# Altium schematic sheet PG13_ REGS_MANAGER.SchDoc: BMU - Regulators
size B; Address1: 3511 EDISON WAY; Address2: MENLO PARK, CA, 94025; DocumentNumber: 1; Revision: 4.1; SheetNumber: 8; SheetTotal: 9
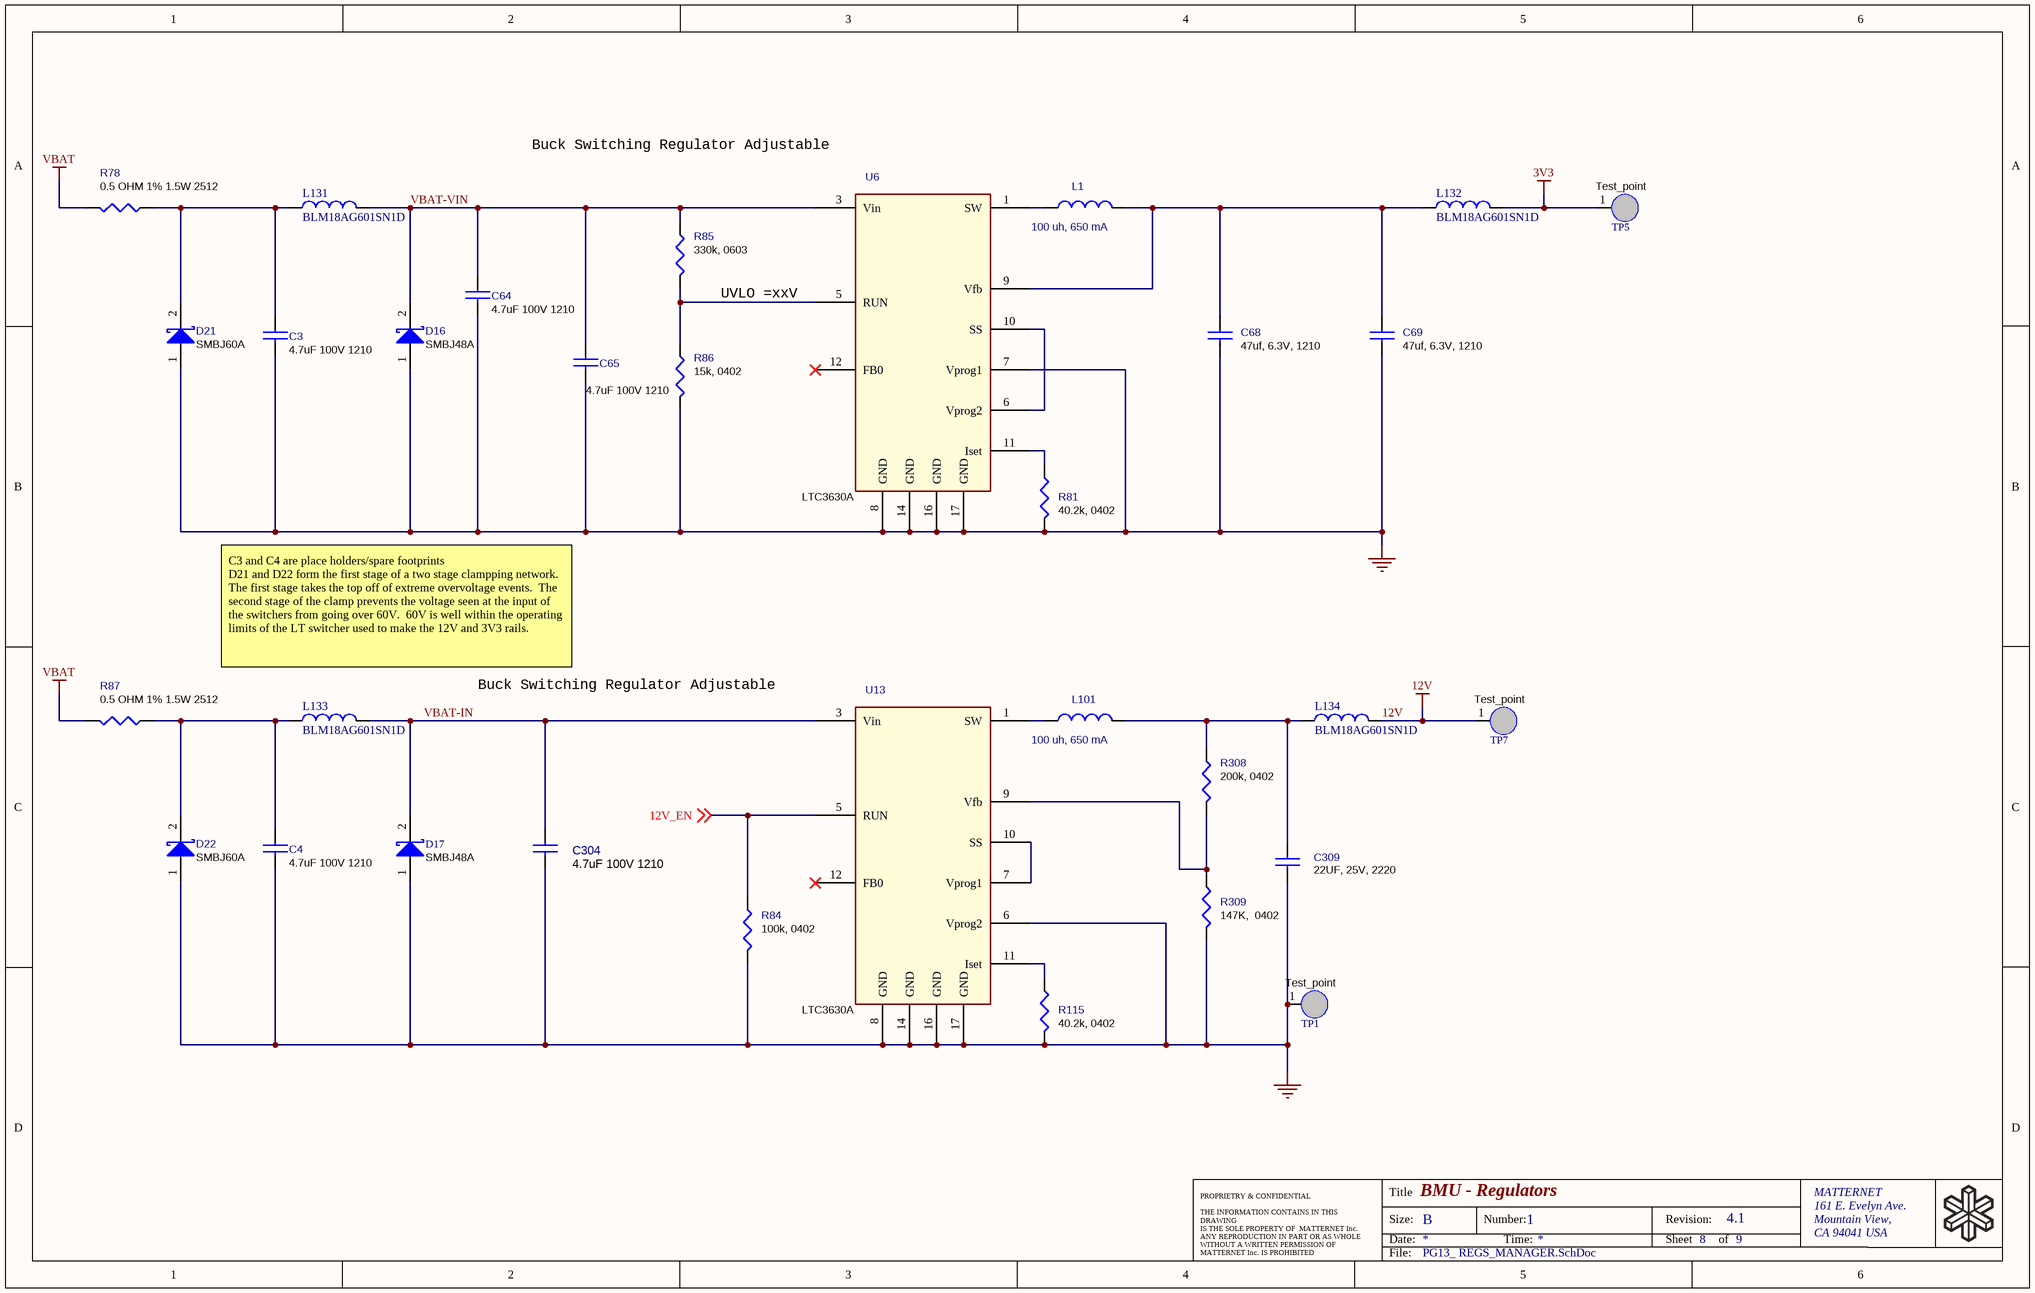
[diagram p0: PG13_ REGS_MANAGER.SchDoc]

## Parts
C3  4.7uF 100V 1210  [C1210]
C4  4.7uF 100V 1210  [C1210]
C64  4.7uF 100V 1210  [C1210]
C65  4.7uF 100V 1210  [C1210]
C68  47uf, 6.3V, 1210  [C1210_N]
C69  47uf, 6.3V, 1210  [C1210_N]
C304  4.7uF 100V 1210  [C1210]
C309  22UF, 25V, 2220  [C2220]
D16  SMBJ48A  [DO-214AA]
D17  SMBJ48A  [DO-214AA]
D21  SMBJ60A  [DO-214AA]
D22  SMBJ60A  [DO-214AA]
L1  100 uh, 650 mA  [IND_SRR7045]
L101  100 uh, 650 mA  [IND_SRR7045]
L131  BLM18AG601SN1D  [INDC1608X10N]
L132  BLM18AG601SN1D  [INDC1608X10N]
L133  BLM18AG601SN1D  [INDC1608X10N]
L134  BLM18AG601SN1D  [INDC1608X10N]
R78  0.5 OHM 1% 1.5W 2512  [2512]
R81  40.2k, 0402  [R0402]
R84  100k, 0402  [R0402]
R85  330k, 0603  [R0603]
R86  15k, 0402  [R0402]
R87  0.5 OHM 1% 1.5W 2512  [2512]
R115  40.2k, 0402  [R0402]
R308  200k, 0402  [R0402]
R309  147K,  0402  [R0402]
TP1  Test_point  [TP]  (no BOM)
TP5  Test_point  [TP]  (no BOM)
TP7  Test_point  [TP]  (no BOM)
U6  LTC3630A  [LTC3630A]
U13  LTC3630A  [LTC3630A]

## Nets
3V3: L132.2 TP5.1
12V: L134.2 TP7.1
GND: C3.2 C4.2 C64.2 C65.2 C68.2 C69.2 C304.2 C309.2 D16.1(A) D17.1(A) D21.1(A) D22.1(A) R81.2 R84.2 R86.2 R115.2 R309.2 TP1.1 U6.7(Vprog1) U6.8(GND) U6.14(GND) U6.16(GND) U6.17(GND) U13.6(Vprog2) U13.8(GND) U13.14(GND) U13.16(GND) U13.17(GND)
VBAT: R78.2 R87.2
12V_EN: R84.1 U13.5(RUN) ; off-sheet 12V_EN
VBAT-IN: C304.1 D17.2(K) L133.2 U13.3(Vin)
VBAT-VIN: C64.1 C65.1 D16.2(K) L131.2 R85.1 U6.3(Vin)
NetC3_1: C3.1 D21.2(K) L131.1 R78.1
NetC4_1: C4.1 D22.2(K) L133.1 R87.1
NetC68_1: C68.1 C69.1 L1.2 L132.1 U6.9(Vfb)
NetC309_1: C309.1 L101.2 L134.1 R308.1
NetL1_1: L1.1 U6.1(SW)
NetL101_1: L101.1 U13.1(SW)
NetR81_1: R81.1 U6.11(Iset)
NetR85_2: R85.2 R86.1 U6.5(RUN)
NetR115_1: R115.1 U13.11(Iset)
NetR308_2: R308.2 R309.1 U13.9(Vfb)
NetU6_6: U6.6(Vprog2) U6.10(SS)
NetU13_7: U13.7(Vprog1) U13.10(SS)

Not connected (* = marked no-connect by the designer): U6 12(FB0)*; U13 12(FB0)*

## Notes on the sheet
- Buck Switching Regulator Adjustable
- (near R85) UVLO =xxV
- C3 and C4 are place holders/spare footprints
  D21 and D22 form the first stage of a two stage clampping network. The first stage takes the top off of extreme overvoltage events.  The second stage of the clamp prevents the voltage seen at the input of the switchers from going over 60V.  60V is well within the operating limits of the LT switcher used to make the 12V and 3V3 rails.
- Title
- Size:
- Date:
- B
- Number:
- Time:
- Revision:
- Sheet
- of
- MATTERNET
- 161 E. Evelyn Ave.
- Mountain View,
- CA 94041 USA
- PROPRIETRY & CONFIDENTIAL
  THE INFORMATION CONTAINS IN THIS DRAWING
  IS THE SOLE PROPERTY OF  MATTERNET Inc.
  ANY REPRODUCTION IN PART OR AS WHOLE
  WITHOUT A WRITTEN PERMISSION OF
  MATTERNET Inc. IS PROHIBITED
- File:

## Library data of the parts
C3 C4 C64 C65 C304 = CAP-GENERIC: CAP CER 4.7UF 100V 10% X7S 1210; Manufacturer: TDK; Manufacturer Part Number: CGA6M3X7S2A475K200AE; ComponentLink1URL: http://www.mouser.com/ds/2/400/lcc_automotive_midvoltage_en-355485.pdf; ComponentLink1Description: http://www.mouser.com/ds/2/400/lcc_automotive_midvoltage_en-355485.pdf; ComponentLink2URL: http://www.farnell.com/datasheets/1839935.pdf; ComponentLink2Description: http://www.farnell.com/datasheets/1839935.pdf; Supplier 1: Digi-Key; Supplier Part Number 1: 445-8790-1-ND; Stock 1: 0; Pricing 1: 1=2.3, 10=1.86, 100=1.42, 500=1.08192 (USD); Mount: Surface Mount; Case/Package: 1210; Weight: 0.000564oz; Case Code (Metric): 3225; Case Code (Imperial): 1210; Min Operating Temperature: -55°C; Max Operating Temperature: 125°C; Tolerance: 10%; Packaging: Tape and Reel; Capacitance: 4.7uF; Voltage Rating: 100V; Termination: SMD/SMT; Package Quantity: 1; Voltage Rating (DC): 100V; Dielectric: X7S; Features: Soft Termination; Length: 3.2mm; Height: 2mm; Width: 0.098inch; Thickness: 0.087inch; Depth: 2.5mm; Ratings: AEC-Q200; REACH SVHC: No SVHC; Lead Free: Lead Free; ComponentLink3URL: http://www.mouser.com/ds/2/400/lcc_commercial_soft_en-775842.pdf; ComponentLink3Description: http://www.mouser.com/ds/2/400/lcc_commercial_soft_en-775842.pdf; Supplier 2: Mouser; Supplier Part Number 2: 810-CGA6M3X7S2A475KS; Stock 2: 205; Pricing 2: 1=2.3, 10=1.86, 50=1.86, 100=1.42, 1000=0.98, 10000=0.98 (USD)
C68 C69 = CAP-Generic-1206: CAP CER 47UF 6.3V X7R 1210; Manufacturer: Murata; Manufacturer Part Number: GCJ32ER70J476KE01L; Tolerance: 10%; Supplier 1: Digi-Key; Supplier Part Number 1: 490-10559-1-ND; Stock 1: 4874; Pricing 1: 1=1.53, 10=1.212, 100=0.9089, 500=0.6867 (USD); Mount: Surface Mount; Case/Package: 1210; Weight: 0.00388oz; Case Code (Metric): 3225; Case Code (Imperial): 1210; Min Operating Temperature: -55°C; Max Operating Temperature: 125°C; Capacitance: 47uF; Packaging: Tape and Reel; Voltage Rating: 6.3V; Dielectric: X7R; Termination: SMD/SMT; Voltage Rating (DC): 6.3V; Package Quantity: 1000; Features: Soft Termination; Length: 0.126inch; Height: 2.5mm; Width: 0.098inch; Thickness: 0.11inch; Ratings: AEC-Q200; Lead Free: Lead Free
C309 = CAP-GENERIC: CAP CER 22UF 25V 10% X7R 2220; Manufacturer: KEMET; Manufacturer Part Number: C2220X226K3RACAUTO; Dielectric Material: Ceramic; ComponentLink1URL: http://www.mouser.com/ds/2/400/lcc_automotive_general_en-843974.pdf; ComponentLink1Description: http://www.mouser.com/ds/2/400/lcc_automotive_general_en-843974.pdf; ComponentLink2URL: http://www.farnell.com/datasheets/1839935.pdf; ComponentLink2Description: http://www.farnell.com/datasheets/1839935.pdf; Supplier 1: Digi-Key; Supplier Part Number 1: 399-7061-1-ND; Stock 1: 500; Pricing 1: 1=6.78, 10=6.101, 100=4.6099 (USD); Mount: Surface Mount; Case/Package: 2220; Case Code (Metric): 5750; Case Code (Imperial): 2220; Min Operating Temperature: -55°C; Max Operating Temperature: 125°C; Package Quantity: 1; Capacitance: 22uF; Voltage Rating: 25V; Tolerance: 10%; Packaging: Cut Tape; Dielectric: X7R; Voltage Rating (DC): 25V; Features: Soft Termination; Length: 0.232inch; Width: 0.197inch; Thickness: 0.1inch; Ratings: AEC-Q200; REACH SVHC: No SVHC
D16 D17 = SMBJ60A: Diode TVS Single Uni-Directional 48V 600W 2-Pin DO-214AA; Manufacturer 1: Taiwan Semiconductor; Clamping Voltage: 77.4V; Polarity: Unidirectional; Max Surge Current: 100A; Breakdown Voltage: 53.3V; Number of Channels: 1; ComponentLink1URL: http://media.digikey.com/pdf/Data%20Sheets/Vishay%20Semiconductors/SMBJ5.0A_thru_188A.pdf?src-supplier=Digi-Key; ComponentLink1Description: http://media.digikey.com/pdf/Data%20Sheets/Vishay%20Semiconductors/SMBJ5.0A_thru_188A.pdf?src-supplier=Digi-Key; ComponentLink2URL: http://www.vishay.com/docs/88392/smbj.pdf?src-supplier=Digi-Key; ComponentLink2Description: http://www.vishay.com/docs/88392/smbj.pdf?src-supplier=Digi-Key; ComponentLink3URL: https://www.verical.com/server-webapp/html/getDatasheet?partID=84761&src-supplier=Verical; ComponentLink3Description: https://www.verical.com/server-webapp/html/getDatasheet?partID=84761&src-supplier=Verical; ComponentLink4URL: http://components.arrow.com/part/dataview/42825922S9422245N5680?src-supplier=Arrow; ComponentLink4Description: http://components.arrow.com/part/dataview/42825922S9422245N5680?src-supplier=Arrow; Supplier 1: Digi-Key; Supplier Part Number 1: SMBJ48AFSCT-ND; Manufacturer Part Number 1: SMBJ48A; RoHS: No; Category: TVS Diodes; Stock 1: 16504; Pricing 1: 1=0.45000, 10=0.36300, 25=0.33200, 100=0.20860, 250=0.20624, 500=0.19312, 1000=0.13133 (USD); Number of Pins: 2; Min Operating Temperature: -65°C; Max Operating Temperature: 150°C; Packaging: Tape and Reel; Peak Pulse Power: 600W; Package Quantity: 3000; Operating Supply Voltage: 48V; Voltage Rating (DC): 48V; Power Rating: 600W; Length: 4.7mm; Height: 2.44mm; Width: 3.94mm; Lead Free: Lead Free; REACH SVHC: No SVHC; ComponentLink5URL: http://www.farnell.com/datasheets/2358777.pdf?src-supplier=Farnell; ComponentLink5Description: http://www.farnell.com/datasheets/2358777.pdf?src-supplier=Farnell; ComponentLink6URL: http://www.mouser.com/ds/2/395/SMBJ%20SERIES-231843.pdf?src-supplier=Mouser; ComponentLink6Description: http://www.mouser.com/ds/2/395/SMBJ%20SERIES-231843.pdf?src-supplier=Mouser; ComponentLink7URL: https://www.taiwansemi.com/products/datasheet/SMBJ%20SERIES_P1812.pdf?src-supplier=Digi-Key; ComponentLink7Description: https://www.taiwansemi.com/products/datasheet/SMBJ%20SERIES_P1812.pdf?src-supplier=Digi-Key
D21 = SMBJ60A: TVS DIODE, 600W, 60V, DO-214AA, FULL REEL; Product Range:TRANSZORB SMBJ Series; TVS Polarity:Unidirectional; Reverse Stand-Off Voltage Vrwm:60V; Diode Case Style:DO-214AA; No. of Pins:2Pins; Breakdown Voltage Min:66.7V ;RoHS Compliant: Yes; Manufacturer 1: Vishay Semiconductors; Manufacturer Part Number 1: SMBJ60A-E3/52; Clamping Voltage: 96.8V; Peak Pulse Current: 6.2A; Test Current: 1mA; Breakdown Voltage: 66.7V; Leakage Current: 1uA; Number of Elements: 1; Element Configuration: Single; Max Breakdown Voltage: 73.7V; ESD Protection: No; ComponentLink1URL: http://media.digikey.com/pdf/Data%20Sheets/Vishay%20Semiconductors/SMBJ5.0A_thru_188A.pdf?src-supplier=Digi-Key; ComponentLink1Description: http://media.digikey.com/pdf/Data%20Sheets/Vishay%20Semiconductors/SMBJ5.0A_thru_188A.pdf?src-supplier=Digi-Key; ComponentLink2URL: http://www.vishay.com/docs/88392/smbj.pdf?src-supplier=Digi-Key; ComponentLink2Description: http://www.vishay.com/docs/88392/smbj.pdf?src-supplier=Digi-Key; ComponentLink3URL: https://www.verical.com/server-webapp/html/getDatasheet?partID=84761&src-supplier=Verical; ComponentLink3Description: https://www.verical.com/server-webapp/html/getDatasheet?partID=84761&src-supplier=Verical; ComponentLink4URL: http://components.arrow.com/part/dataview/42825922S9422245N5680?src-supplier=Arrow; ComponentLink4Description: http://components.arrow.com/part/dataview/42825922S9422245N5680?src-supplier=Arrow; Supplier 1: Digi-Key; Supplier Part Number 1: SMBJ60A-E3/52GICT-ND; RoHS: Yes; Category: TVS Diodes; Stock 1: 694; Pricing 1: 1=0.47000, 10=0.35600, 25=0.32080, 100=0.16910, 250=0.16732 (USD); Mount: Surface Mount; Case/Package: SMB; Number of Pins: 2; Contact Plating: Tin,Matte; Min Operating Temperature: -55°C; Max Operating Temperature: 150°C; Peak Pulse Power: 600W; Polarity: Unidirectional; Reverse Standoff Voltage: 60V; Packaging: Tape and Reel; Max Surge Current: 6.2A; Package Quantity: 750; Reverse Breakdown Voltage: 66.7V; Operating Supply Voltage: 60V; Number of Channels: 1; Min Breakdown Voltage: 66.7V; Direction: Unidirectional; Max Reverse Leakage Current: 1uA; Termination: SMD/SMT; Max Power Dissipation: 600W; Power Dissipation: 600W; Length: 5.59mm; Height: 2.44mm; Width: 3.94mm; Radiation Hardening: No; Lead Free: Lead Free; ComponentLink5URL: https://datasheet.ciiva.com/15143/getdatasheetpartid-84761-15143331.pdf?src-supplier=Verical; ComponentLink5Description: https://datasheet.ciiva.com/15143/getdatasheetpartid-84761-15143331.pdf?src-supplier=Verical; ComponentLink6URL: https://datasheet.ciiva.com/4249/smbj50a-4249846.pdf?src-supplier=Arrow; ComponentLink6Description: https://datasheet.ciiva.com/4249/smbj50a-4249846.pdf?src-supplier=Arrow; ComponentLink7URL: https://datasheet.ciiva.com/330/smbj50a-330945.pdf?src-supplier=Digi-Key; ComponentLink7Description: https://datasheet.ciiva.com/330/smbj50a-330945.pdf?src-supplier=Digi-Key; ComponentLink8URL: https://datasheet.ciiva.com/330/smbj50a-330946.pdf?src-supplier=Digi-Key; ComponentLink8Description: https://datasheet.ciiva.com/330/smbj50a-330946.pdf?src-supplier=Digi-Key; ComponentLink9URL: https://datasheet.ciiva.com/330/smbj50a-330944.pdf?src-supplier=Digi-Key; ComponentLink9Description: https://datasheet.ciiva.com/330/smbj50a-330944.pdf?src-supplier=Digi-Key
D22 = SMBJ60A: TVS DIODE, 600W, 60V, DO-214AA, FULL REEL; Product Range:TRANSZORB SMBJ Series; TVS Polarity:Unidirectional; Reverse Stand-Off Voltage Vrwm:60V; Diode Case Style:DO-214AA; No. of Pins:2Pins; Breakdown Voltage Min:66.7V ;RoHS Compliant: Yes; Manufacturer: Vishay Semiconductors; Manufacturer Part Number: SMBJ60A-E3/52; Clamping Voltage: 96.8V; Peak Pulse Current: 6.2A; Test Current: 1mA; Min Breakdown Voltage: 66.7V; Max Reverse Leakage Current: 1uA; Element Configuration: Single; Number of Elements: 1; Max Breakdown Voltage: 73.7V; ESD Protection: No; Supplier 1: Mouser; Supplier Part Number 1: 625-SMBJ60A-E3; Stock 1: 9885; Pricing 1: 1=0.52, 10=0.301, 50=0.301, 100=0.175, 1000=0.11, 10000=0.083 (USD); Mount: Surface Mount; Case/Package: SMB; Number of Pins: 2; Contact Plating: Matte,Tin; Min Operating Temperature: -55°C; Max Operating Temperature: 150°C; Packaging: Tape and Reel; Peak Pulse Power: 600W; Direction: Unidirectional; Package Quantity: 750; Reverse Standoff Voltage: 60V; Polarity: Unidirectional; Power Dissipation: 600W; Max Surge Current: 6.2A; Reverse Breakdown Voltage: 66.7V; Breakdown Voltage: 66.7V; Leakage Current: 1uA; Termination: SMD/SMT; Max Power Dissipation: 600W; Operating Supply Voltage: 60V; Number of Channels: 1; Length: 5.59mm; Height: 2.44mm; Width: 3.94mm; Radiation Hardening: No; Lead Free: Lead Free; ComponentLink1URL: http://media.digikey.com/pdf/Data%20Sheets/Vishay%20Semiconductors/SMBJ5.0A_thru_188A.pdf?src-supplier=Digi-Key; ComponentLink1Description: http://media.digikey.com/pdf/Data%20Sheets/Vishay%20Semiconductors/SMBJ5.0A_thru_188A.pdf?src-supplier=Digi-Key; ComponentLink2URL: http://www.vishay.com/docs/88392/smbj.pdf?src-supplier=Digi-Key; ComponentLink2Description: http://www.vishay.com/docs/88392/smbj.pdf?src-supplier=Digi-Key; ComponentLink3URL: https://www.verical.com/server-webapp/html/getDatasheet?partID=84761&src-supplier=Verical; ComponentLink3Description: https://www.verical.com/server-webapp/html/getDatasheet?partID=84761&src-supplier=Verical; ComponentLink4URL: http://components.arrow.com/part/dataview/42825922S9422245N5680?src-supplier=Arrow; ComponentLink4Description: http://components.arrow.com/part/dataview/42825922S9422245N5680?src-supplier=Arrow; Supplier 2: Digi-Key; Supplier Part Number 2: SMBJ60A-E3/52GIDKR-ND; Stock 2: 2980; Pricing 2: 1=0.37, 10=0.296, 25=0.2712, 100=0.2018, 250=0.18284 (USD); Supplier 3: Digi-Key; Supplier Part Number 3: SMBJ60A-E3/52GICT-ND; Manufacturer 3: Vishay Semiconductors; Manufacturer Part Number 3: SMBJ60A-E3/52; RoHS: Yes; Category: TVS Diodes; Stock 3: 694; Pricing 3: 1=0.47000, 10=0.35600, 25=0.32080, 100=0.16910, 250=0.16732 (USD); ComponentLink5URL: https://datasheet.ciiva.com/15143/getdatasheetpartid-84761-15143331.pdf?src-supplier=Verical; ComponentLink5Description: https://datasheet.ciiva.com/15143/getdatasheetpartid-84761-15143331.pdf?src-supplier=Verical; ComponentLink6URL: https://datasheet.ciiva.com/4249/smbj50a-4249846.pdf?src-supplier=Arrow; ComponentLink6Description: https://datasheet.ciiva.com/4249/smbj50a-4249846.pdf?src-supplier=Arrow; ComponentLink7URL: https://datasheet.ciiva.com/330/smbj50a-330945.pdf?src-supplier=Digi-Key; ComponentLink7Description: https://datasheet.ciiva.com/330/smbj50a-330945.pdf?src-supplier=Digi-Key; ComponentLink8URL: https://datasheet.ciiva.com/330/smbj50a-330946.pdf?src-supplier=Digi-Key; ComponentLink8Description: https://datasheet.ciiva.com/330/smbj50a-330946.pdf?src-supplier=Digi-Key; ComponentLink9URL: https://datasheet.ciiva.com/330/smbj50a-330944.pdf?src-supplier=Digi-Key; ComponentLink9Description: https://datasheet.ciiva.com/330/smbj50a-330944.pdf?src-supplier=Digi-Key
L1 L101 = IND-GENERIC: FIXED IND 100UH 650MA 300 MOHM; Manufacturer: Bourns; Manufacturer Part Number: SRR7045-101M; custinv: Ansync; custprt: 100-0600-000108; Option: AB; Tolerance: 20%; Resistance: 300MR; Saturation Current: 500mA; Supplier 1: Digi-Key; Supplier Part Number 1: SRR7045-101MCT-ND; DC Current: 650mA; Inductance: 100uh; DC Resistance (DCR): 300mR
L131-L134 = BLM18AG601SN1D: FERRITE BEAD 600 OHM 0603 1LN; ComponentLink1Description: Reference Spec; ComponentLink1URL: https://www.murata.com/en-us/products/productdata/8796738650142/ENFA0003.pdf; Supplier 1: Digi-Key; Supplier 2: Digi-Key; Supplier 3: Mouser; Supplier Part Number 1: 490-1014-1-ND; Supplier Part Number 2: 490-1014-2-ND; Supplier Part Number 3: 81-BLM11A601S
R78 R87 = R-Generic: VISHAY - WSL2512R5000FEA - SMD Current Sense Resistors, AEC-Q200 WSL Series, 0.5 ohm, 1 W, - 1%, 700 mV RoHS Compliant: Yes; Manufacturer 1: Vishay Dale; Resistance: 0R5; Power Rating: 1W; Temperature Coefficient: 75ppm/°C; Voltage Rating: 700mV; Supplier 1: Digi-Key; Supplier Part Number 1: WSLG-.50CT-ND; Manufacturer Part Number 1: WSL2512R5000FEA; RoHS: Yes; Category: Chip SMD Resistors; Stock 1: 80272; Pricing 1: 1=1.16000, 10=1.02300, 25=0.94040, 50=0.85800, 100=0.74250, 250=0.62700, 500=0.52800, 1000=0.44880 (USD); Mount: Surface Mount; Case/Package: 2512; Number of Pins: 2; Weight: 0.001429oz; Contact Plating: Tin,Matte; Case Code (Imperial): 2512; Case Code (Metric): 6432; Min Operating Temperature: -65°C; Max Operating Temperature: 170°C; Tolerance: 1%; Composition: Metal Strip; Packaging: Tape and Reel; Package Quantity: 2000; Termination: SMD/SMT; Military Standard: Not; Length: 6.35mm; Height: 0.635mm; Width: 3.2mm; Depth: 3.18mm; Radiation Hardening: No; Lead Free: Lead Free; REACH SVHC: Unknown; ComponentLink1URL: https://datasheet.ciiva.com/15159/getdatasheetpartid-92560-15159917.pdf?src-supplier=Verical; ComponentLink1Description: https://datasheet.ciiva.com/15159/getdatasheetpartid-92560-15159917.pdf?src-supplier=Verical; ComponentLink2URL: https://datasheet.ciiva.com/11812/0900766b80d81e3e-11812159.pdf?src-supplier=RSComponents; ComponentLink2Description: https://datasheet.ciiva.com/11812/0900766b80d81e3e-11812159.pdf?src-supplier=RSComponents; ComponentLink3URL: https://datasheet.ciiva.com/16722/70201098-16722472.pdf?src-supplier=Allied+Electronics; ComponentLink3Description: https://datasheet.ciiva.com/16722/70201098-16722472.pdf?src-supplier=Allied+Electronics; ComponentLink4URL: https://datasheet.ciiva.com/28671/wsl-28671816.pdf?src-supplier=Element14; ComponentLink4Description: https://datasheet.ciiva.com/28671/wsl-28671816.pdf?src-supplier=Element14; ComponentLink5URL: https://datasheet.ciiva.com/16507/wsl-16507529.pdf?src-supplier=Future+Electronics; ComponentLink5Description: https://datasheet.ciiva.com/16507/wsl-16507529.pdf?src-supplier=Future+Electronics; ComponentLink6URL: https://datasheet.ciiva.com/7702/442550-7702493.pdf?src-supplier=Element14; ComponentLink6Description: https://datasheet.ciiva.com/7702/442550-7702493.pdf?src-supplier=Element14; ComponentLink7URL: https://datasheet.ciiva.com/7702/442550-7702494.pdf?src-supplier=Element14; ComponentLink7Description: https://datasheet.ciiva.com/7702/442550-7702494.pdf?src-supplier=Element14; ComponentLink8URL: https://datasheet.ciiva.com/8932/wsl-8932367.pdf?src-supplier=Avnet; ComponentLink8Description: https://datasheet.ciiva.com/8932/wsl-8932367.pdf?src-supplier=Avnet
R81 R115 = R-Generic-0402: RES SMD 40.2K OHM 1% 1/16W 0402; Manufacturer: Yageo; Manufacturer Part Number: RC0402FR-0740K2L; custinv: Ansync; custprt: 100-0120-000050; Option: AB; Resistance: 40.2kR; Temperature Coefficient: 100ppm/°C; Power Rating: 62.5mW; Voltage Rating: 50V; Max Power Dissipation: 63mW; Supplier 1: Digi-Key; Supplier Part Number 1: 311-40.2KLRCT-ND; Stock 1: 1176562; Pricing 1: 1=0.09, 10=0.016, 100=0.0064, 1000=0.00288, 2500=0.0025, 5000=0.00206 (EUR); Case/Package: 0402; Contact Plating: Matte,Tin; Case Code (Metric): 1005; Case Code (Imperial): 0402; Min Operating Temperature: -55°C; Max Operating Temperature: 155°C; Tolerance: 1%; Composition: Thick Film; Package Quantity: 1; Packaging: Tape and Reel; Number of Terminations: 2; Termination: SMD/SMT; Military Standard: Not; Voltage Rating (DC): 50V; Features: Moisture Resistant; Length: 0.039inch; Height: 0.016inch; Width: 0.02inch; Depth: 0.5mm; Lead Free: Lead Free; ComponentLink1URL: http://www.yageo.com/documents/recent/PYu-RC0402_51_RoHS_L_6.pdf; ComponentLink1Description: http://www.yageo.com/documents/recent/PYu-RC0402_51_RoHS_L_6.pdf; ComponentLink2URL: http://www.yageo.com/documents/recent/PYu-RC_Group_51_RoHS_L_9.pdf; ComponentLink2Description: http://www.yageo.com/documents/recent/PYu-RC_Group_51_RoHS_L_9.pdf; ComponentLink3URL: http://www.mouser.com/ds/2/447/PYu-RC0402_51_RoHS_L_6_r-8721.pdf; ComponentLink3Description: http://www.mouser.com/ds/2/447/PYu-RC0402_51_RoHS_L_6_r-8721.pdf; ComponentLink4URL: http://www.yageo.com/documents/recent/PYu-RC0402_51_RoHS_L_6_r.pdf; ComponentLink4Description: http://www.yageo.com/documents/recent/PYu-RC0402_51_RoHS_L_6_r.pdf
R84 = R-Generic-0402: RES SMD 100K OHM 1% 1/16W 0402; Manufacturer: Yageo; Manufacturer Part Number: RC0402FR-07100KL; custinv: Ansync; custprt: 100-0120-000011; Option: AB; Resistance: 100kR; Temperature Coefficient: 100ppm/°C; Power Rating: 63mW; Voltage Rating: 50V; Supplier 1: Digi-Key; Supplier Part Number 1: 311-100KLRCT-ND; Stock 1: 17114602; Pricing 1: 1=0.1, 10=0.018, 100=0.0073, 1000=0.00329, 2500=0.00286, 5000=0.00236 (USD); Case/Package: 0402; Case Code (Metric): 1005; Case Code (Imperial): 0402; Min Operating Temperature: -55°C; Max Operating Temperature: 155°C; Tolerance: 1%; Composition: Thick Film; Packaging: Tape and Reel; Package Quantity: 1; Number of Terminations: 2; Termination: SMD/SMT; Military Standard: Not; Max Power Dissipation: 63mW; Working Voltage: 50V; Features: Moisture Resistant; Length: 0.039inch; Height: 0.016inch; Width: 0.02inch; Depth: 0.5mm; REACH SVHC: No SVHC; Lead Free: Lead Free; ComponentLink1URL: http://www.yageo.com/documents/recent/PYu-RC_Group_51_RoHS_L_9.pdf; ComponentLink1Description: http://www.yageo.com/documents/recent/PYu-RC_Group_51_RoHS_L_9.pdf; ComponentLink2URL: http://www.farnell.com/datasheets/1018594.pdf; ComponentLink2Description: http://www.farnell.com/datasheets/1018594.pdf; ComponentLink3URL: http://www.yageo.com/documents/recent/PYu-RC_Group_51_RoHS_L_8.pdf; ComponentLink3Description: http://www.yageo.com/documents/recent/PYu-RC_Group_51_RoHS_L_8.pdf; ComponentLink4URL: http://documents.rs-components.com/techlib://itc_doclist_GB.htm?stockno=6185797; ComponentLink4Description: http://documents.rs-components.com/techlib://itc_doclist_GB.htm?stockno=6185797
R85 = R-Generic-0603: RES SMD 330K OHM 5% 1/10W 0603; Manufacturer: Yageo; Manufacturer Part Number: RC0603JR-07330KL; custprt: 100-0110-000011; custinv: Ansync; Option: AB; Resistance: 330kR; Power Rating: 100mW; Voltage Rating: 75V; Voltage Rating (DC): 50V; Temperature Coefficient: 100ppm/°C; Supplier 1: Digi-Key; Supplier Part Number 1: 311-330KGRCT-ND; Stock 1: 271870; Pricing 1: 1=0.1, 10=0.022, 100=0.0088, 1000=0.00396, 2500=0.00344 (USD); Case/Package: 0603; Number of Pins: 2; Weight: 7.1E-05oz; Case Code (Imperial): 0603; Case Code (Metric): 1608; Min Operating Temperature: -55°C; Max Operating Temperature: 155°C; Tolerance: 5%; Packaging: Tape and Reel; Package Quantity: 1; Termination: SMD/SMT; Composition: Thick Film; Number of Terminations: 2; Military Standard: Not; Max Power Dissipation: 100mW; Features: Moisture Resistant; Length: 1.6mm; Height: 0.022inch; Width: 0.8mm; Depth: 0.8mm; REACH SVHC: No SVHC; Lead Free: Lead Free; ComponentLink1URL: http://www.yageo.com/documents/recent/PYu-RC_Group_51_RoHS_L_9.pdf; ComponentLink1Description: http://www.yageo.com/documents/recent/PYu-RC_Group_51_RoHS_L_9.pdf; ComponentLink2URL: http://www.farnell.com/datasheets/443971.pdf; ComponentLink2Description: http://www.farnell.com/datasheets/443971.pdf; ComponentLink3URL: https://www.verical.com/server-webapp/html/getDatasheet?partID=323834; ComponentLink3Description: https://www.verical.com/server-webapp/html/getDatasheet?partID=323834
R86 = R-Generic-0402: RES SMD 15K OHM 1% 1/16W 0402; Manufacturer: Yageo; Manufacturer Part Number: RC0402FR-0715KL; custinv: Ansync; custprt: 100-0120-000195; Option: AB; Power Rating: 62.5mW; Resistance: 15kR; Voltage Rating: 50V; Temperature Coefficient: 100ppm/°C; Max Power Dissipation: 63mW; Supplier 1: Digi-Key; Supplier Part Number 1: 311-15.0KLRCT-ND; Stock 1: 2807614; Pricing 1: 1=0.1, 10=0.018, 100=0.0073, 1000=0.00329, 2500=0.00286, 5000=0.00236 (USD); Case/Package: 0402; Number of Pins: 2; Weight: 2.3E-05oz; Case Code (Imperial): 0402; Case Code (Metric): 1005; Min Operating Temperature: -55°C; Max Operating Temperature: 155°C; Tolerance: 1%; Packaging: Tape and Reel; Package Quantity: 1; Termination: SMD/SMT; Composition: Thick Film; Number of Terminations: 2; Military Standard: Not; Voltage Rating (DC): 50V; Features: Moisture Resistant; Length: 1mm; Height: 0.016inch; Width: 0.5mm; Depth: 0.5mm; REACH SVHC: No SVHC; Lead Free: Lead Free; ComponentLink1URL: http://www.farnell.com/datasheets/1018594.pdf; ComponentLink1Description: http://www.farnell.com/datasheets/1018594.pdf; ComponentLink2URL: http://www.mouser.com/ds/2/447/PYu-RC0402_51_RoHS_L_6_r-8721.pdf; ComponentLink2Description: http://www.mouser.com/ds/2/447/PYu-RC0402_51_RoHS_L_6_r-8721.pdf; ComponentLink3URL: http://www.yageo.com/documents/recent/PYu-RC_Group_51_RoHS_L_9.pdf; ComponentLink3Description: http://www.yageo.com/documents/recent/PYu-RC_Group_51_RoHS_L_9.pdf; ComponentLink4URL: http://www.yageo.com/documents/recent/PYu-RC0402_51_RoHS_L_6_r.pdf; ComponentLink4Description: http://www.yageo.com/documents/recent/PYu-RC0402_51_RoHS_L_6_r.pdf
R308 = R-Generic-0402: RES SMD 200K OHM 1% 1/16W 0402; Manufacturer: Yageo; Manufacturer Part Number: RC0402FR-07200KL; custinv: Ansync; custprt: 100-0120-000047; Option: AB; Resistance: 200kR; Power Rating: 62.5mW; Voltage Rating: 50V; Max Power Dissipation: 63mW; Temperature Coefficient: 100ppm/°C; Supplier 1: Digi-Key; Supplier Part Number 1: 311-200KLRCT-ND; Stock 1: 7446238; Pricing 1: 1=0.1, 10=0.018, 100=0.0073, 1000=0.00329, 2500=0.00286, 5000=0.00236 (USD); Case/Package: 0402; Case Code (Metric): 1005; Case Code (Imperial): 0402; Min Operating Temperature: -55°C; Max Operating Temperature: 155°C; Tolerance: 1%; Package Quantity: 1; Packaging: Tape and Reel; Composition: Thick Film; Number of Terminations: 2; Termination: SMD/SMT; Military Standard: Not; Voltage Rating (DC): 50V; Working Voltage: 50V; Features: Moisture Resistant; Length: 1mm; Height: 0.016inch; Width: 0.02inch; Depth: 0.5mm; REACH SVHC: No SVHC; Lead Free: Lead Free; ComponentLink1URL: http://www.yageo.com/documents/recent/PYu-RC_Group_51_RoHS_L_9.pdf; ComponentLink1Description: http://www.yageo.com/documents/recent/PYu-RC_Group_51_RoHS_L_9.pdf; ComponentLink2URL: https://www.verical.com/server-webapp/html/getDatasheet?partID=323720; ComponentLink2Description: https://www.verical.com/server-webapp/html/getDatasheet?partID=323720; ComponentLink3URL: http://www.mouser.com/ds/2/447/PYu-RC0402_51_RoHS_L_6_r-8721.pdf; ComponentLink3Description: http://www.mouser.com/ds/2/447/PYu-RC0402_51_RoHS_L_6_r-8721.pdf; ComponentLink4URL: http://www.farnell.com/datasheets/1018594.pdf; ComponentLink4Description: http://www.farnell.com/datasheets/1018594.pdf; ComponentLink5URL: http://www.farnell.com/datasheets/2167052.pdf; ComponentLink5Description: http://www.farnell.com/datasheets/2167052.pdf; ComponentLink6URL: http://www.yageo.com/documents/recent/PYu-RC0402_51_RoHS_L_6_r.pdf; ComponentLink6Description: http://www.yageo.com/documents/recent/PYu-RC0402_51_RoHS_L_6_r.pdf
R309 = R-Generic-0402: RES SMD 147K OHM 1% 1/16W 0402; Manufacturer: Yageo; Manufacturer Part Number: RC0402FR-07147KL; custinv: Ansync; custprt: 100-0120-000047; Option: AB; Resistance: 147kR; Power Rating: 62.5mW; Voltage Rating: 50V; Max Power Dissipation: 63mW; Temperature Coefficient: 100ppm/°C; Supplier 1: Digi-Key; Supplier Part Number 1: YAG2981CT-ND; Stock 1: 461716; Pricing 1: 1=0.1, 10=0.018, 100=0.0073, 1000=0.00329, 2500=0.00286, 5000=0.00236 (USD); Case/Package: 0402; Case Code (Imperial): 0402; Case Code (Metric): 1005; Min Operating Temperature: -55°C; Max Operating Temperature: 155°C; Tolerance: 1%; Packaging: Tape and Reel; Composition: Thick Film; Number of Terminations: 2; Termination: SMD/SMT; Military Standard: Not; Voltage Rating (DC): 50V; Features: Moisture Resistant; Length: 1mm; Height: 0.016inch; Width: 0.02inch; Depth: 0.5mm; Lead Free: Lead Free; ComponentLink1URL: https://www.verical.com/server-webapp/html/getDatasheet?partID=329230; ComponentLink1Description: https://www.verical.com/server-webapp/html/getDatasheet?partID=329230; ComponentLink2URL: http://www.yageo.com/documents/recent/PYu-RC0402_51_RoHS_L_6_r.pdf; ComponentLink2Description: http://www.yageo.com/documents/recent/PYu-RC0402_51_RoHS_L_6_r.pdf
U6 U13 = LTC3630A: IC REG BUCK INV 0.5A SYNC 16MSOP; Manufacturer: Analog Devices / Linear Technology; Manufacturer Part Number: LTC3630AIMSE#TRPBF; custinv: Ansync; custprt: 100-0700-000511; Option: AB; Output Current: 500mA; Number of Outputs: 1; Output Voltage: 76V; Synchronous Rectifier: Yes; Min Input Voltage: 4V; Output Type: Adjustable; Supplier 1: Digi-Key; Supplier Part Number 1: LTC3630AIMSE#TRPBFCT-ND; Supplier 2: Newark; Supplier Part Number 2: 95W3377; Case/Package: SOP; Number of Pins: 12; Min Operating Temperature: -40°C; Max Operating Temperature: 125°C; Package Quantity: 37; Packaging: Rail/Tube; ComponentLink1URL: http://www.linear.com/docs/44087; ComponentLink1Description: http://www.linear.com/docs/44087